# EAGLE board rev_m_v4 (EAGLE 9.7.0)
REV: M
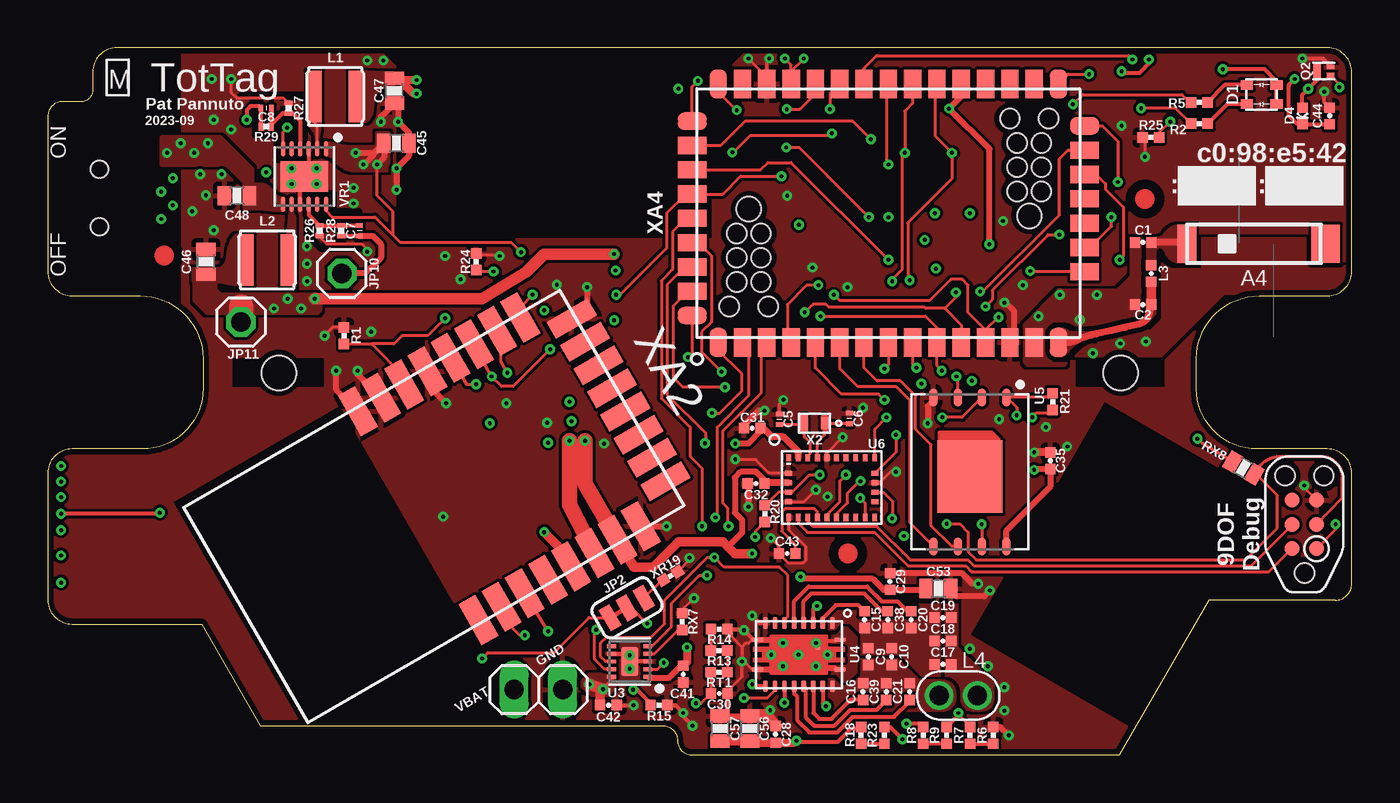
[diagram p5: board, top side]
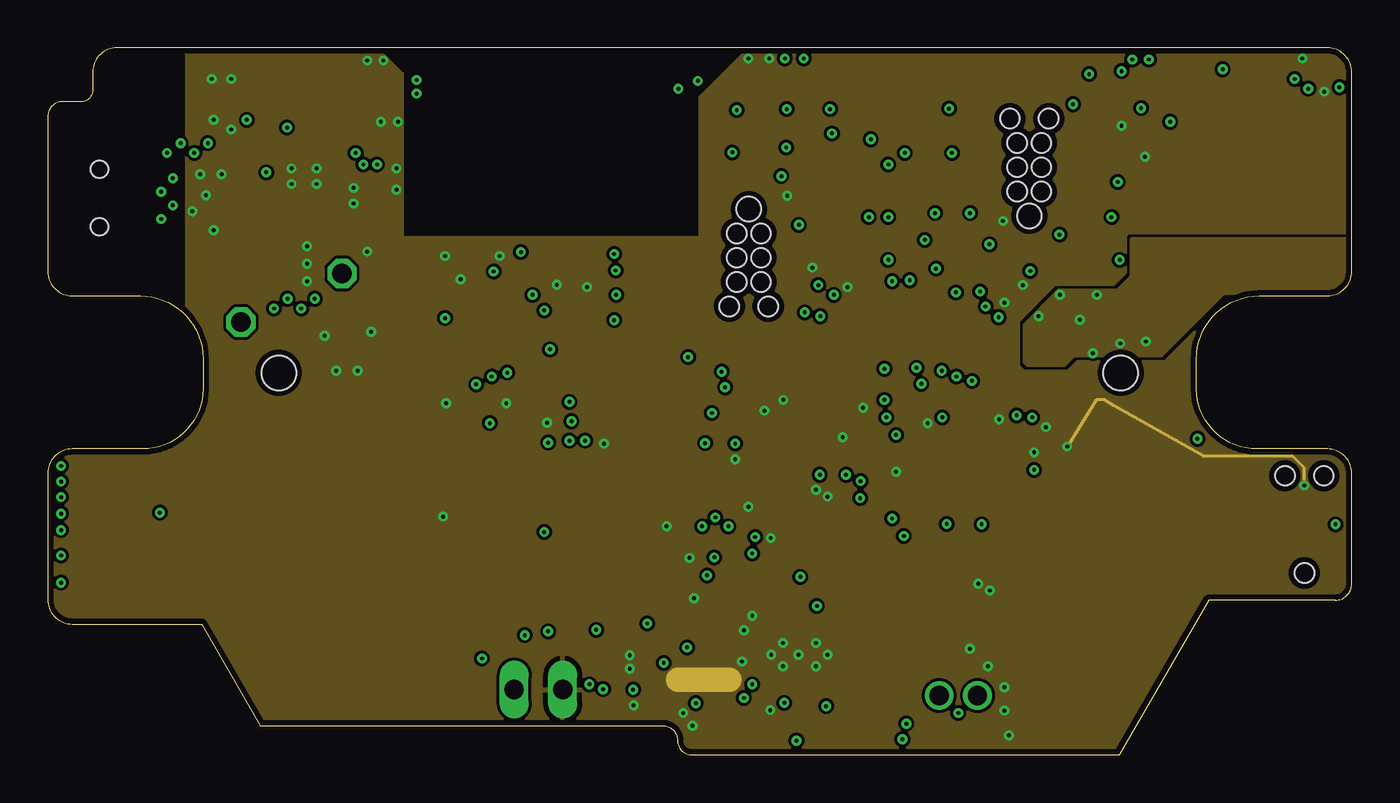
[diagram p6: board, inner layer Route2]
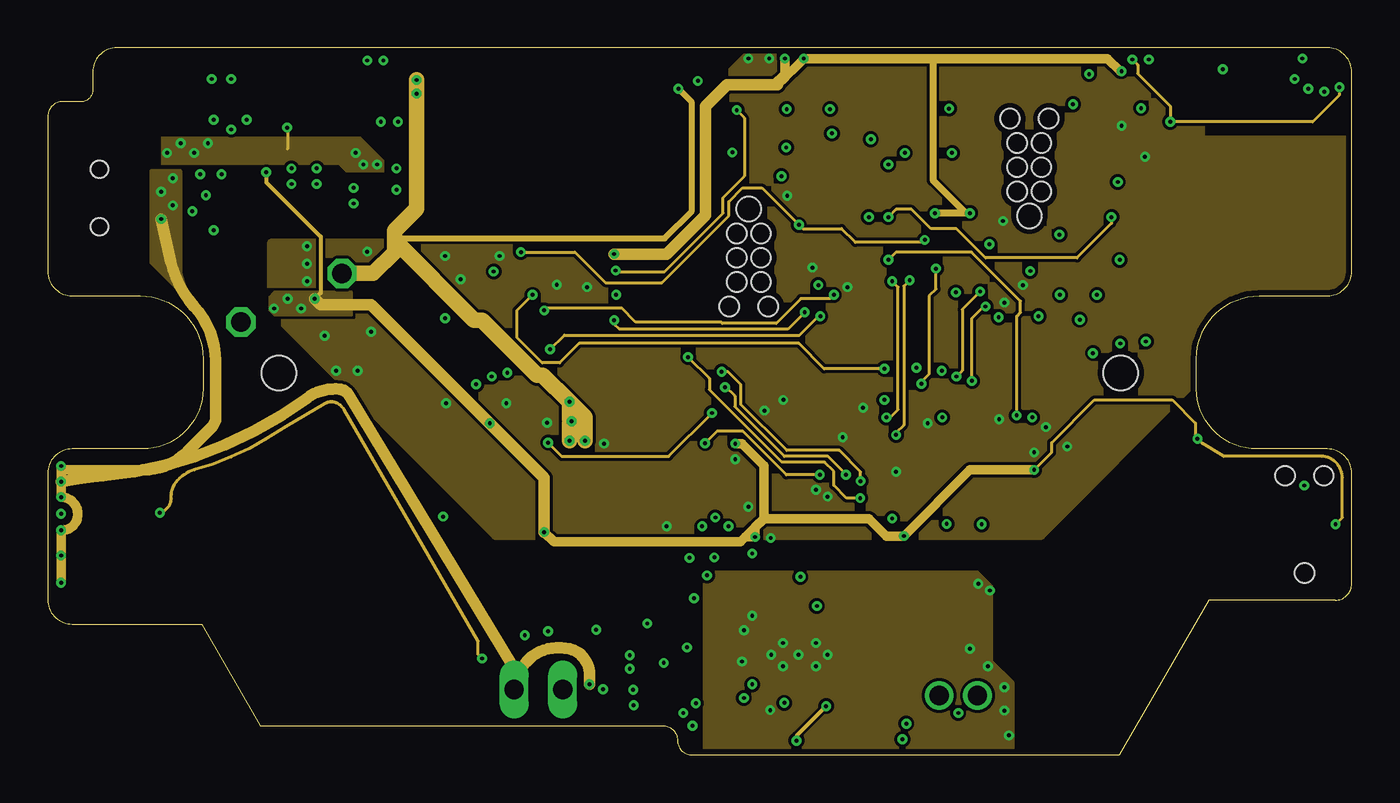
[diagram p7: board, inner layer Route15]
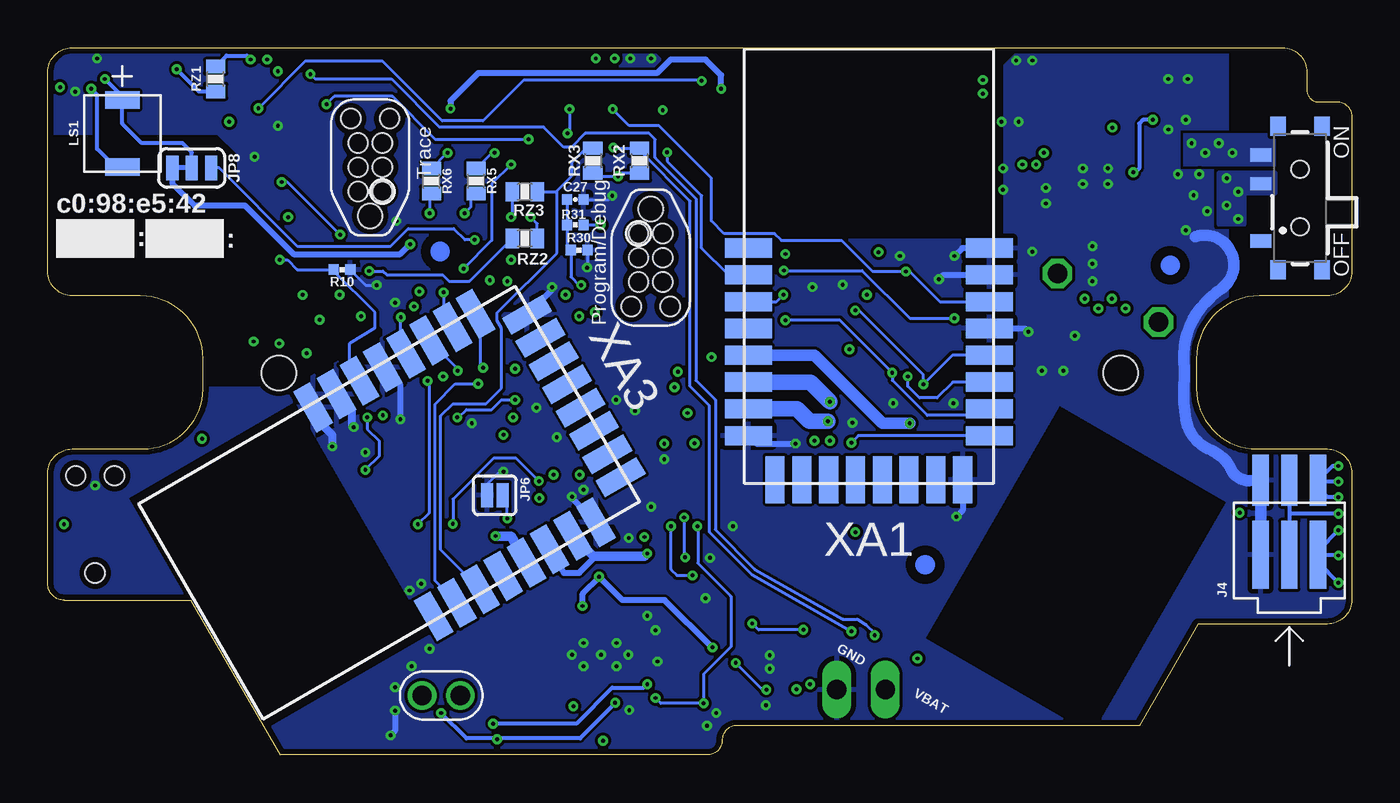
[diagram p8: board, bottom side, seen from below]

Size 68.14 x 36.93 mm. Coordinates in mm from the lower left corner, seen from the top.
Outline: 66.87,36.93 3.61,36.93 arc90 2.34,35.66 2.34,34.7 arc-90 1.76,34.12 0.76,34.12 arc90 0,33.36 0,25.25 arc90 1.27,23.98 4.83,23.98 arc-90 8.11,20.69 8.11,19.14 arc-90 4.95,15.98 1.27,15.98 arc90 0,14.71 0,8.1 arc90 1.27,6.83 8.03,6.83 11.11,1.52 32.14,1.52 arc-90 32.9,0.76 arc90 33.66,0 55.99,0 60.66,8.08 67.29,8.08 arc90 68.14,8.92 68.14,14.71 arc90 66.87,15.98 63.18,15.98 arc-90 60.02,19.14 60.02,20.69 arc-90 63.31,23.98 66.87,23.98 arc90 68.14,25.25 68.14,35.66 arc90 66.87,36.93
Copper layers (1+2*15+16): Top 0.0356mm / dielectric 0.18mm / Route2 0.0356mm / dielectric 1.03mm / Route15 0.0356mm / dielectric 0.18mm / Bottom 0.0356mm
Design rules "quickturn_co_kr_1oz_4lyr *": minimum track width 6mil, minimum drill 8mil, track to track 6mil, track to pad 6mil, pad to pad 6mil, via to via 12mil, smd to smd 6mil, copper to edge 12mil, drill to drill 12mil, minimum pad ring 8mil, minimum via ring 6mil, stop-mask expansion 4mil, vias tented up to drill 10mil, thermal gap 10mil
Net classes: 1 BLE_RF: width 0.356 mm, clearance 0.254 mm; 2 UWB_RF: width 0.356 mm, clearance 0.254 mm
Holes 1.8 mm at 12.07,19.95 56.07,19.95
tRestrict: area 9.7,19.3 to 14.4,20.7; area 53.8,19.3 to 58.3,20.7; area 13.4,26.4 to 16.5,29.4; area 10,31 to 13.5,34.6

## Footprints (pad centres in the part's own frame; a part is rotated, then mirrored left to right if it is on the bottom)
AMCA72-2R470G-S1F-T = smd 2 x 1.5: NC 0,3.75 | smd 2 x 1: S1 0,-3.5
0402_CAP = smd 0.536 x 0.546: 1 -0.433,0; 2 0.433,0
0201_CAP = smd 0.25 x 0.35: P$1 -0.275,0; P$2 0.275,0
0603_CAP = smd 0.7 x 1: 1 -0.65,0; 2 0.65,0
LED-0606 = smd 0.65 x 0.5: A1 0.775,0.5; A2 0.775,-0.5; C1 -0.775,0.5; C2 -0.775,-0.5
0402_DIODE = smd 0.536 x 0.546: ANODE -0.433,0; CATHODE 0.433,0
TC2030-IDC-NL = smd 0.787 x 0.787: 1 -1.27,-0.635; 2 -1.27,0.635; 3 0,-0.635; 4 0,0.635; 5 1.27,-0.635; 6 1.27,0.635 | hole 1.016: -2.54,0; 2.54,1.016; 2.54,-1.016
MOLEX-PICO-SPOX-3_SIDE = smd 3.55 x 0.85: 1 -1.725,1.5; 2 -1.725,0; 3 -1.725,-1.5 | smd 2.65 x 0.85: 1SUPP 2.175,1.5; 2SUPP 2.175,0; 3SUPP 2.175,-1.5
SMT-JUMPER_3_1-NC_TRACE_SILK = smd 0.635 x 1.27: 1 -1.016,0; 2 0,0; 3 1.016,0
SMT-JUMPER_2_NO_SILK = smd 0.635 x 1.27: 1 -0.406,0; 2 0.406,0
1X02 = drill 1.016 long: 1 -1.27,0; 2 1.27,0
1X01 = drill 1.016 octagon: 1 0,0
NRX3015 = smd 0.8 x 2.7: P$1 -1.1,0; P$2 1.1,0
WURTH_COIL_760308103204 = drill 1: P$1 0,1; P$2 0,-1
SMT-0440-T-2-R = smd 0.9 x 1.8: + 1.75,0; - -1.75,0
XFDFN-3 = smd 0.4 x 0.7: D 0.35,0 | smd 0.4 x 0.25: G -0.35,0.215; S -0.35,-0.215
0402_RES = smd 0.536 x 0.546: 1 -0.433,0; 2 0.433,0
0201_RES = smd 0.28 x 0.43: 1 -0.255,0; 2 0.255,0
0603-RES = smd 0.7 x 1: 1 -0.65,0; 2 0.65,0
450404015514 = smd 0.7 x 1.1: 1 2.25,-2.05; 2 -0.75,-2.05; 3 -2.25,-2.05 | smd 1 x 0.8: Z1 -3.75,1.15; Z2 3.75,1.15; Z3 3.75,-1.15; Z4 -3.75,-1.15 | hole 0.9: -1.5,0; 1.5,0
DSQ0010A = smd 0.5 x 0.2: 1 -0.95,0.8; 2 -0.95,0.4; 3 -0.95,0; 4 -0.95,-0.4; 5 -0.95,-0.8; 6 0.95,-0.8; 7 0.95,-0.4; 8 0.95,0; 9 0.95,0.4; 10 0.95,0.8 | smd 0.9 x 1.5: PAD 0,0
RHL0020A = smd 0.24 x 0.6: 1 -0.775,2.15; 10 -0.775,-2.15; 11 0.775,-2.15; 20 0.775,2.15 | smd 0.6 x 0.24: 2 -1.65,1.75; 3 -1.65,1.25; 4 -1.65,0.75; 5 -1.65,0.25; 6 -1.65,-0.25; 7 -1.65,-0.75; 8 -1.65,-1.25; 9 -1.65,-1.75; 12 1.65,-1.75; 13 1.65,-1.25; 14 1.65,-0.75; 15 1.65,-0.25; 16 1.65,0.25; 17 1.65,0.75; 18 1.65,1.25; 19 1.65,1.75; PAD -0.55,1
WSON127P800X600X80-9T430X340N = smd 0.94 x 0.445: 1 -3.896,1.905; 2 -3.896,0.635; 3 -3.896,-0.635; 4 -3.896,-1.905; 5 3.896,-1.905; 6 3.896,-0.635; 7 3.896,0.635; 8 3.896,1.905 | smd 3.8 x 3.4: PAD 0.25,0
LGA28R0P510X4_5P2X3P8X1 = smd 0.25 x 0.375: 1 -2.25,1.562; 6 -2.25,-1.562; 7 -1.75,-1.562; 8 -1.25,-1.562; 9 -0.75,-1.562; 10 -0.25,-1.562; 11 0.25,-1.562; 12 0.75,-1.562; 13 1.25,-1.562; 14 1.75,-1.562; 15 2.25,-1.562; 20 2.25,1.562; 21 1.75,1.562; 22 1.25,1.562; 23 0.75,1.562; 24 0.25,1.562; 25 -0.25,1.562; 26 -0.75,1.562; 27 -1.25,1.562; 28 -1.75,1.562 | smd 0.375 x 0.25: 2 -2.263,0.75; 3 -2.263,0.25; 4 -2.263,-0.25; 5 -2.263,-0.75; 16 2.263,-0.75; 17 2.263,-0.25; 18 2.263,0.25; 19 2.263,0.75
SON45P300X300X80-13T160X250N = smd 0.813 x 0.224: 1 -1.445,1.125; 2 -1.445,0.675; 3 -1.445,0.225; 4 -1.445,-0.225; 5 -1.445,-0.675; 6 -1.445,-1.125; 7 1.445,-1.125; 8 1.445,-0.675; 9 1.445,-0.225; 10 1.445,0.225; 11 1.445,0.675; 12 1.445,1.125 | smd 1.6 x 2.5: 13 0,0
TXC-9HT12 = smd 0.4 x 0.6: 1 -0.53,0 | smd 0.4 x 0.86: 2 0.53,0
DWM3000 = smd 2.45 x 1: 1 -6.295,12.3; 2 -6.295,10.9; 3 -6.295,9.5; 4 -6.295,8.1; 5 -6.295,6.7; 6 -6.295,5.3; 7 -6.295,3.9; 8 -6.295,2.5; 17 6.295,2.5; 18 6.295,3.9; 19 6.295,5.3; 20 6.295,6.7; 21 6.295,8.1; 22 6.295,9.5; 23 6.295,10.9; 24 6.295,12.3 | smd 1 x 2.45: 9 -4.9,0.205; 10 -3.5,0.205; 11 -2.1,0.205; 12 -0.7,0.205; 13 0.7,0.205; 14 2.1,0.205; 15 3.5,0.205; 16 4.9,0.205
APOLLO4_BLUEPLUS_MODULE = smd 1.5 x 0.9: P1 -6.75,8.89; P2 -6.75,7.62; P3 -6.75,6.35; P4 -6.75,5.08; P5 -6.75,3.81; P6 -6.75,2.54; P7 -6.75,1.27; P8 -6.75,0; P9 -6.75,-1.27; P10 -6.75,-2.54; P11 -6.75,-3.81; P12 -6.75,-5.08; P13 -6.75,-6.35; P14 -6.75,-7.62; P15 -6.75,-8.89; P25 6.75,-8.89; P26 6.75,-7.62; P27 6.75,-6.35; P28 6.75,-5.08; P29 6.75,-3.81; P30 6.75,-2.54; P31 6.75,-1.27; P32 6.75,0; P33 6.75,1.27; P34 6.75,2.54; P35 6.75,3.81; P36 6.75,5.08; P37 6.75,6.35; P38 6.75,7.62; P39 6.75,8.89 | smd 0.9 x 1.5: P18 -3.06,-10.25; P19 -1.79,-10.25; P20 -0.52,-10.25; P21 0.75,-10.25; P22 2.02,-10.25; P23 3.29,-10.25; P24 4.56,-10.25; P40 4.81,10.25; P41 3.54,10.25; P42 2.27,10.25; P43 1,10.25; P44 -0.27,10.25; P45 -1.54,10.25; P46 -2.81,10.25; P47 -4.08,10.25; P48 -5.35,10.25 | hole 1.27: -0.143,-7.366; 0.213,7.29 | hole 1.016: 4.937,-6.35; 4.937,-8.382; 1.127,-8.001; 1.127,-6.731; 2.397,-8.001; 2.397,-6.731; 3.667,-6.731; 3.667,-8.001; -4.867,6.274; -4.867,8.306; -1.057,7.925; -1.057,6.655; -2.327,7.925; -2.327,6.655; -3.597,6.655; -3.597,7.925

## Placement (x,y rotation side)
A4  AMCA72-2R47G-S1F-T  [AMCA72-2R470G-S1F-T]  63.02,26.7 270 top
C1  0.5pF  [0402_CAP]  57.23,26.77 180 top
C2  0.8pF  [0402_CAP]  57.23,23.52 180 top
C5  4pF  [0201_CAP]  38.23,17.53 270 top
C6  4pF  [0201_CAP]  41.89,17.58 270 top
C7  22pF  [0201_CAP]  16.29,27.38 90 top
C8  22pF  [0201_CAP]  11.41,33.78 180 top
C9  470pF  [0402_CAP]  42.88,5.13 270 top
C10  470pF  [0402_CAP]  44.1,5.13 270 top
C15  10nF  [0402_CAP]  42.68,7.06 270 top
C16  10nF  [0402_CAP]  42.6,3.3 90 top
C17  22nF  [0402_CAP]  46.77,4.72 0 top
C18  22nF  [0402_CAP]  46.77,5.94 0 top
C19  22nF  [0402_CAP]  46.77,7.16 0 top
C20  22nF  [0402_CAP]  45.12,7.06 270 top
C21  22nF  [0402_CAP]  45.04,3.3 90 top
C27  0.1uF  [0402_CAP]  40.57,29.01 0 bottom
C28  0.1uF  [0402_CAP]  38.03,1.07 90 top
C29  0.1uF  [0402_CAP]  44.01,9.05 90 top
C30  0.1uF  [0402_CAP]  35.08,3.2 0 top
C31  0.1uF  [0402_CAP]  36.81,17.07 180 top
C32  0.1uF  [0402_CAP]  37.01,14.17 180 top
C35  0.1uF  [0402_CAP]  52.39,15.36 90 top
C38  0.47uF  [0402_CAP]  43.9,7.06 270 top
C39  0.47uF  [0402_CAP]  43.82,3.3 90 top
C41  1uF  [0402_CAP]  33.2,4.22 270 top
C42  1uF  [0402_CAP]  29.29,2.59 0 top
C43  1uF  [0402_CAP]  38.64,10.52 180 top
C44  1uF  [0402_CAP]  66.99,33.38 90 top
C45  4.7uF  [0603_CAP]  18.22,31.95 180 top
C46  4.7uF  [0603_CAP]  8.26,25.76 90 top
C47  4.7uF  [0603_CAP]  18.12,34.7 90 top
C48  4.7uF  [0603_CAP]  9.89,29.21 180 top
C53  10uF  [0603_CAP]  46.54,8.69 0 top
C56  10uF  [0603_CAP]  36.68,1.37 90 top
C57  10uF  [0603_CAP]  35.13,1.37 90 top
D1  BICOLOR-SMD  [LED-0606]  63.43,34.49 0 top
D4  DIODE0402  [0402_DIODE]  65.56,33.38 270 top
FD1  FIDUCIAL  [FIDUCIAL_1MM-CU_2MM-MASK]  6.08,26.09 0 top
FD2  FIDUCIAL  [FIDUCIAL_1MM-CU_2MM-MASK]  57.34,29.03 0 top
FD3  FIDUCIAL  [FIDUCIAL_1MM-CU_2MM-MASK]  41.81,10.52 0 top
FD4  FIDUCIAL  [FIDUCIAL_1MM-CU_2MM-MASK]  9.48,25.58 0 bottom
FD5  FIDUCIAL  [FIDUCIAL_1MM-CU_2MM-MASK]  47.64,26.29 0 bottom
FD6  FIDUCIAL  [FIDUCIAL_1MM-CU_2MM-MASK]  22.29,9.93 0 bottom
J1  TC2030-JLINK-NL  [TC2030-IDC-NL]  65.67,12.04 90 top
J4  MOLEX-PICO-SPOX-3SIDE  [MOLEX-PICO-SPOX-3_SIDE]  3.26,12.17 90 bottom
JP2  JUMPER-SMT_3_1-NC_TRACE_SILK  [SMT-JUMPER_3_1-NC_TRACE_SILK]  30.26,7.67 210 top
JP6  JUMPER-SMT_2_NO_SILK  [SMT-JUMPER_2_NO_SILK]  44.78,13.56 0 bottom
JP8  JUMPER-SMT_3_1-NC_TRACE_SILK  [SMT-JUMPER_3_1-NC_TRACE_SILK]  60.61,30.66 180 bottom
JP9  [1X02]  25.64,3.4 0 top
JP10  [1X01]  15.37,25.15 180 top
JP11  [1X01]  10.09,22.61 0 top
L1  10uH  [NRX3015]  15.02,34.39 0 top
L2  10uH  [NRX3015]  11.46,25.86 0 top
L3  4.7nH  [0402_CAP]  57.66,25.15 270 top
L4  WURTH_COIL_760308103204  [WURTH_COIL_760308103204]  47.58,3.1 270 top
LS1  PUI_SMT-0440-T-2-R  [SMT-0440-T-2-R]  64.24,32.46 90 bottom
Q2  MOSFET-NCHANNELXFDN-3  [XFDFN-3]  66.68,35.71 180 top
R1  100k  [0402_RES]  15.48,21.89 270 top
R2  5.1  [0402_RES]  60.18,32.97 180 top
R5  15  [0402_RES]  60.18,34.09 180 top
R6  97.6  [0402_RES]  49.41,1.02 90 top
R7  97.6  [0402_RES]  48.19,1.02 270 top
R8  162  [0402_RES]  45.75,1.02 270 top
R9  162  [0402_RES]  46.97,1.02 90 top
R10  100k  [0402_RES]  52.76,25.35 180 bottom
R13  1k  [0402_RES]  35.08,5.44 0 top
R14  1k  [0402_RES]  35.08,6.56 180 top
R15  2.2k  [0402_RES]  31.93,2.59 180 top
R18  10k  [0402_RES]  42.5,1.02 270 top
R20  10k  [0402_RES]  37.47,12.6 270 top
R21  10k  [0402_RES]  52.51,18.45 270 top
R23  10k  [0402_RES]  43.72,1.02 90 top
R24  100k  [0402_RES]  22.38,25.76 270 top
R25  100k  [0402_RES]  57.64,32.26 180 top
R26  261k  [0201_RES]  14.21,27.38 90 top
R27  402k  [0201_RES]  12.58,33.78 270 top
R28  845k  [0201_RES]  15.32,27.38 270 top
R29  845k  [0201_RES]  11.41,32.82 0 top
R30  1.87M  [0402_RES]  40.37,26.37 180 bottom
R31  5.1M  [0402_RES]  40.57,27.69 0 bottom
RT1  10k@25C  [0402_RES]  35.08,4.31 180 top
RX2  DNP  [0603-RES]  37.22,31.04 270 bottom
RX3  DNP  [0603-RES]  39.66,31.04 270 bottom
RX5  DNP  [0603-RES]  45.75,29.97 90 bottom
RX6  DNP  [0603-RES]  48.09,29.97 90 bottom
RX7  DNP  [0402_RES]  33.15,6.96 270 top
RX8  DNP  [0603-RES]  62.48,14.99 150 top
RZ1  0  [0603-RES]  59.37,35.31 90 bottom
RZ2  0  [0603-RES]  43.21,26.97 180 bottom
RZ3  0  [0603-RES]  43.21,29.41 180 bottom
S1  [450404015514]  2.7,29.08 270 bottom
U3  BQ24040  [DSQ0010A]  30.41,4.88 180 top
U4  BQ51013B  [RHL0020A]  39.25,5.23 270 top
U5  W25N01GWZEIG  [WSON127P800X600X80-9T430X340N]  48.19,14.78 270 top
U6  BNO055  [LGA28R0P510X4_5P2X3P8X1]  40.96,13.96 0 top
VR1  RT8020RT8020GQW  [SON45P300X300X80-13T160X250N]  13.41,30.21 270 top
X2  TXC-9HT12  [TXC-9HT12]  40.06,17.32 180 top
XA1  DWM3000  [DWM3000]  25.23,14.17 0 bottom
XA2  DWM3000  [DWM3000]  30,18.64 120 top
XA3  DWM3000  [DWM3000]  40.47,18.85 120 bottom
XA4  APOLLO4_BLUEPLUS_MODULE  [APOLLO4_BLUEPLUS_MODULE]  43.92,28.3 90 top
XR19  10k  [0402_RES]  32.54,9.35 210 top

## Tracks (layer width: path | path; a pad name or v marks a point on that pad's centre or on a via)
9DOF_!BOOT_LOAD_PIN  (via drill 0.2)
  Top 0.152: R20.1 37.5,13.03 38.18,13.71 U6.4 38.89,13.71 39.81,14.63 v40.34,14.63 | XA4.P46 33.29,25.49 32.37,24.56 32.37,18.82 34.37,16.81 34.37,16.31 v34.35,16.28
  Route15 0.152: v40.34,14.63 38.59,14.63 36.3,16.92 34.98,16.92 v34.35,16.28
9DOF_!RESET  (via drill 0.2)
  Top 0.152: XA4.P45 33.98,26.76 34.68,26.06 34.68,22.61 34.17,22.1 34.17,21.06 v35.21,20.02 | U6.11 41.21,12.58 41.79,13.16 41.79,13.67 42.45,14.33 v42.47,14.3 | v46.97,12.06 47.66,12.06 48.09,11.63 48.09,10.62 48.52,10.19 62.11,10.19 62.16,10.19 62.59,10.19 64.24,11.84 64.24,13.56 63.15,14.66 RX8.1 63.3,15.02 arc-56 64.45,15.6 arc2 66.48,15.6 66.53,15.6 arc-90 67.65,14.48 67.65,13.44 J1.3
  Route15 0.152: v42.47,14.3 42.47,14.78 41.36,15.9 38.61,15.9 36.2,18.31 36.2,19.35 35.54,20.02 v35.21,20.02
  Bottom 0.152: v42.47,14.3 43.67,15.49 44.84,15.49 46.97,13.36 v46.97,12.06
9DOF_BL_IND  (via drill 0.2)
  Top 0.152: XA4.P47 33.44,24.22 32.67,23.44 32.67,19.74 33.2,19.2 v35.39,19.2 | U6.10 40.71,12.54 41.38,13.21 41.38,14.3 v41.71,14.63
  Route15 0.152: v41.71,14.63 41.71,14.66 40.77,15.6 38.49,15.6 35.9,18.19 35.9,18.75 35.44,19.2 v35.39,19.2
9DOF_CAP
  Top 0.152: U6.9 40.21,12.7 40.06,12.85 38.51,12.85 38.36,12.7 38.36,11.68 39.07,10.97 C43.1
9DOF_INT  (via drill 0.2)
  Top 0.152: XA4.P48 33.67,20.99 v33.46,20.78 | U6.14 42.71,13.15 v42.45,13.41
  Route15 0.152: v42.45,13.41 41.74,13.41 41.08,14.07 41.08,14.81 40.6,15.29 38.36,15.29 34.58,19.08 34.58,19.66 v33.46,20.78
9DOF_SCL-COM1  (via drill 0.2)
  Top 0.152: XA4.P30 46.36,34.94 46.36,32.33 v47.25,31.45 47.25,30.1 44.94,27.79 44.94,24.89 v45.04,24.79 | U6.19 44.33,15.82 v44.33,16.71
  Route15 0.152: v44.33,16.71 44.33,16.81 44.74,17.22 44.74,24.49 v45.04,24.79
  Bottom 0.152: RX6.2 47.27,31.45 v47.25,31.45
9DOF_SDA-COM0  (via drill 0.2)
  Top 0.152: XA4.P31 45.19,34.04 44.79,33.63 v44.79,31.45 44.63,31.29 44.63,25.35 44.13,24.84 v44.13,24.74 | U6.20 43.21,17.02 v43.82,17.63
  Route15 0.152: v43.82,17.63 44.02,17.63 44.43,18.03 44.43,24.43 v44.13,24.74
  Bottom 0.152: RX5.2 44.93,31.45 v44.79,31.45
9DOF_SWCLK
  Top 0.152: U6.8 39.71,12.2 39.99,11.92 43.33,11.92 45.07,10.19 48.09,10.19 48.39,9.88 62.9,9.88 65.03,12.01 J1.4
9DOF_SWDIO
  Top 0.152: U6.7 39.21,12.1 39.7,11.61 43.2,11.61 44.95,9.87 47.97,9.87 48.27,9.58 63.81,9.58 65,10.77 J1.2
9DOF_XI
  Top 0.152: U6.27 39.71,15.63 39.82,15.73 39.82,16.33 39.53,16.61 X2.2 39.46,17.25 C5.P$2
9DOF_XO
  Top 0.152: U6.26 40.21,16.33 40.59,16.71 X2.1 41.87,17.32 C6.P$2
!CHG  (via drill 0.2)
  Top 0.152: U4.7 38.5,7.07 38.67,7.24 38.67,9.37 38.23,9.8 35.34,9.8 v34.83,10.31 34.47,10.31 32.24,8.08 32.24,6.86 31.53,6.15 29.19,6.15 28.89,5.84 28.89,5.13 29.14,4.88 U3.8 | XA4.P2 36.61,21.24 36.61,18.75 34.98,17.12 34.98,12.5 v34.88,12.4
  Bottom 0.152: v34.88,12.4 34.88,10.36 v34.83,10.31
!DWM1_RST  (via drill 0.2)
  Top 0.152: v38.34,30.23 36.2,30.23 35.27,29.3 XA4.P43 33.34,29.3 32.34,28.3 32.34,26.47 29.9,24.03 v29.7,24.03
  Bottom 0.152: RX2.2 38.17,30.39 v38.34,30.23 39.49,30.23 RX3.2 | XA1.3 30.05,23.67 v29.7,24.03
!DWM1_SPI_CS  (via drill 0.2)
  Top 0.152: v34.7,17.86 35.11,17.86 36.25,19 36.25,19.92 35.03,21.14 XA4.P1
  Route15 0.152: v26.14,16.31 26.85,15.6 32.44,15.6 v34.7,17.86
  Bottom 0.152: XA1.17 25.78,16.67 v26.14,16.31
!DWM2_RST  (via drill 0.2)
  Top 0.152: v26.14,6.45 XA2.3 | v42.91,28.09 39.27,31.72 v38.59,31.72
  Bottom 0.152: v26.14,6.45 31.36,9.43 33.56,11.63 33.56,18.24 34.58,19.25 34.58,28.93 37.22,31.57 RX2.1 38.55,31.69 v38.59,31.72 | RZ2.1 42.56,27.75 v42.91,28.09
!DWM2_SPI_CS  (via drill 0.2)
  Top 0.152: XA4.P8 43.92,20.37 v43.72,20.17 | XA2.17 24.69,23.39 v25.33,24.03
  Route15 0.152: v43.72,20.17 40.57,20.17 39.25,21.49 27.77,21.49 26.75,20.47 25.84,20.47 24.52,21.79 24.52,23.22 v25.33,24.03
!DWM3_RST
  Bottom 0.152: RX3.1 40.02,31.69 40.77,30.94 40.77,30.23 41.54,29.46 | XA3.3 47.61,10.7 47.61,17.7 46.97,18.34 45.24,18.34 44.43,19.15 44.43,22.28 44.66,22.68 44.66,23.09 41.54,26.21 41.54,29.46 | RZ3.1 41.59,29.41 41.54,29.46
!DWM3_SPI_CS  (via drill 0.2)
  Top 0.152: XA4.P9 45.19,20.42 v45.4,20.22
  Bottom 0.152: XA3.17 45.55,22.82 45.55,20.37 v45.4,20.22
!PG  (via drill 0.2)
  Top 0.152: U3.5 31.56,5.68 32.58,6.69 32.58,7.91 34.04,9.37 v34.45,9.37 | v35.57,11.94 35.52,11.99 35.52,12.9 35.29,13.13 35.29,16.92 37.27,18.9 37.27,21.24 XA4.P3
  Bottom 0.152: v34.45,9.37 35.26,9.37 35.57,9.68 v35.57,11.94
+1V8  (via drill 0.2)
  Top 0.152: R20.2 36.96,11.66 v36.96,11.38 | R21.2 52.33,17.83 51.64,17.83 v51.44,17.63 | v39.5,36.37 38.84,35.71 XA4.P36 38.84,36.04 v38.51,36.37 | RX8.2 60.32,16.27 v60.08,16.51 | J1.1 67.29,11.76 v67.29,12.04
  Top 0.203: R29.1 11.14,32.84 C8.P$2 11.03,33.88 10.6,33.88 10.39,33.68 v10.39,33.17 | v57.54,36.32 57.54,36.12 57.03,35.61 56.22,35.61 v56.11,35.71
  Top 0.305: U5.8 50.09,11.71 52.39,14 C35.1 51.59,14.93 v51.54,14.88 | C31.1 37.24,16.89 36.61,16.26 v35.92,16.26
  Top 0.356: U6.28 39.21,15.83 38.44,16.61 37.85,16.61 37.4,17.07 C31.1
  Top 0.508: XA2.5 27.35,10.22 v25.94,11.63
  Top 0.61: v13.95,23.83 22.69,23.83 25.03,25.25 25.94,26.16 v29.6,26.16
  Top 1.27: JP11.1 10.09,23.42
  Route15 0.152: v51.54,14.88 52.46,15.8 52.46,16.31 54.69,18.54 58.76,18.54 59.98,17.32 59.98,16.61 v60.08,16.51 60.32,16.27 61.45,15.6 66.58,15.6 arc-87 67.65,14.48 67.65,12.4 v67.29,12.04
  Route15 0.203: v11.41,30.43 11.41,29.92 14.26,27.08 14.26,24.13 v13.95,23.83
  Route15 0.356: v46.36,28.3 v48.19,28.3 47.99,28.3 46.26,30.02 46.26,36.37
  Route15 0.508: v38.51,36.37 38.51,35.48 | 38.13,35 v39.5,36.37 46.26,36.37 55.38,36.37 56.04,35.71 v56.11,35.71 | v25.94,11.63 26.45,11.13 36.2,11.13 36.46,11.38 | 37.42,12.34 42.91,12.34 43.82,11.43 v44.74,11.43 48.19,14.88 v51.54,14.88 | v35.92,16.26 36.28,16.26 37.42,15.11 37.42,12.34 | 36.46,11.38 36.96,11.89 | 36.96,11.89 37.42,12.34 | 36.46,11.38 v36.96,11.38 36.96,11.89
  Route15 0.61: v13.95,23.83 14.26,23.52 16.9,23.52 v23.09,17.32 25.94,14.48 v25.94,11.63 | 38.51,35.48 38.03,35 | 38.13,35 38.03,35 | 38.03,35 35.49,35 34.37,33.88 34.37,28.19 32.34,26.16 v29.6,26.16
  Bottom 0.152: RX5.1 46.06,29.02 46.06,28.6 v46.36,28.3 | RX6.1 48.19,29.22 v48.19,28.3 | v51.44,17.63 51.44,17.02 50.83,16.41 50.83,15.6 v51.54,14.88
  Bottom 0.203: v10.39,33.17 10.9,33.17 11.11,32.97 11.11,30.63 11.31,30.43 v11.41,30.43 | RZ1.2 58.8,36.53 57.74,36.53 v57.54,36.32
  Bottom 0.508: XA3.5 43.92,11.43 v44.74,11.43
  Bottom 0.61: XA1.5 28.07,20.87 24.51,17.32 v23.1,17.32 v23.09,17.32
  other vias: 11.82,23.32 12.53,23.83 13.24,23.32
  pour Top (isolate 0.102, no thermals): 14.15,24.12 9.07,24.12 8.86,24.33 8.86,25.03 7.56,25.03 7.56,23.73 8.27,23.03 14.15,23.03 14.34,23.22 14.34,23.92
  pour Top (isolate 0.102, no thermals): 9.74,24.61 10.67,24.61 10.67,27.13 9.97,27.13 9.89,27.12 9.82,27.09 9.77,27.05 9.72,26.99 9.59,26.77 9.49,26.52 9.43,26.27 9.41,26.02 9.41,26.02 9.4,26 9.4,25.98 9.4,25.98 9.39,25.89 9.39,25.88 9.39,25.87 9.39,25.86 9.38,25.85 9.35,25.76 9.35,25.75 9.35,25.74 9.34,25.73 9.34,25.72 9.29,25.63 9.29,25.63 9.28,25.62 9.28,25.61 9.27,25.6 9.21,25.53 9.21,25.52 9.2,25.51 9.19,25.5 9.19,25.5 9.16,25.47 9.15,25.45 9.14,25.45 9.14,25.45 9.13,25.44 9.08,25.41 9.07,25.41 9.07,25.4 9.06,25.4 9.05,25.4 9,25.38 8.99,25.38 8.98,25.38 8.97,25.38 8.96,25.38 8.92,25.38 8.92,25.37 8.9,25.37 8.88,25.37 8.88,25.37 7.6,25.37 7.6,24.74 8.88,24.74 8.88,24.74 8.9,24.74 8.92,24.74 8.92,24.74 9.07,24.73 9.08,24.73 9.09,24.73 9.1,24.73 9.11,24.72 9.25,24.69 9.25,24.69 9.27,24.69 9.29,24.68 9.29,24.68 9.51,24.63
  pour Route15 (rank 2): 11.84,22.96 15.9,22.96 15.9,24.18 11.84,24.18 11.56,23.91 11.56,23.24
+2V5  (via drill 0.2)
  Top 0.203: R28.2 16.27,27.13 C7.P$1
  Top 0.305: C7.P$1 16.97,27.11 17.41,26.67 17.41,25.96 16.59,25.15 JP10.1 | C47.2 18.32,35.35 | C32.1 37.45,14.35 37.01,14.78 36.2,14.78 35.9,14.48 35.9,12.65 36.28,12.27 36.28,11.61 35.54,10.87 | XA4.P29 47.73,34.39 v47.1,33.76 49.21,31.65 v49.21,26.67
  Top 0.356: U6.3 37.49,14.21 C32.1
  Top 0.406: v19.26,34.54 19.12,34.54 18.32,35.35 | C47.2 18.22,35.24 19.25,35.24 v19.26,35.26
  Top 0.508: v36.81,10.52 35.9,10.52 35.54,10.87 35.29,11.13 32.95,11.13 31.63,9.8 30.64,9.8 XA2.7
  Top 0.813: XA2.7 28.07,14.17 v28.07,16.41 | XA2.6 27.26,13.06 v27.26,16.41
  Route15 0.305: 18.12,26.87 18.22,26.97 32.24,26.97 33.66,28.4 33.66,34.09 v32.95,34.8
  Route15 0.813: v19.26,35.26 19.26,28.53 18.12,27.38 18.12,26.87 | 18.12,26.87 18.12,26.26 17,25.15 JP10.1 | 18.12,26.87 22.28,22.71 22.7,22.71 25.57,19.84 25.86,19.84 v27.26,18.44 | v27.26,18.44 27.26,17.53 v27.36,17.42 27.26,17.32 v27.26,16.41 | v27.26,18.44 28.07,17.63 v28.07,16.41
  Bottom 0.305: XA3.6 41.18,9.5 40.37,9.5 39.5,10.36 | JP8.3 61.63,29.84 60.48,28.7 57.84,28.7 55.3,26.16 49.71,26.16 v49.21,26.67 | v32.95,34.8 32.95,35.51 33.76,36.32 35.59,36.32 36.3,35.61 45.65,35.61 47.1,34.16 v47.1,33.76
  Bottom 0.508: XA3.7 39.62,10.36 39.5,10.36 36.96,10.36 v36.81,10.52
  Bottom 0.813: XA1.7 28.98,18.07 28.33,17.42 v27.36,17.42 | XA1.6 28.29,19.47 v27.26,18.44
  pour Top (isolate 0.102, no thermals): 15.81,33.12 16.54,33.12 16.6,33.13 16.66,33.14 16.7,33.17 16.74,33.21 16.84,33.37 16.91,33.54 16.96,33.72 16.97,33.9 16.97,33.9 16.97,33.92 16.98,33.94 16.98,33.94 16.99,34.14 16.99,34.15 17,34.16 17,34.17 17,34.18 17.06,34.39 17.06,34.4 17.06,34.41 17.07,34.42 17.07,34.43 17.17,34.62 17.17,34.63 17.18,34.64 17.18,34.65 17.19,34.65 17.32,34.83 17.32,34.83 17.33,34.84 17.34,34.85 17.35,34.85 17.38,34.88 17.39,34.89 17.39,34.9 17.4,34.9 17.41,34.91 17.45,34.93 17.46,34.94 17.47,34.94 17.48,34.95 17.49,34.95 17.53,34.96 17.54,34.97 17.55,34.97 17.56,34.97 17.57,34.97 17.61,34.97 17.61,34.98 17.63,34.98 17.64,34.98 17.65,34.98 18.41,34.99 18.41,34.99 18.43,34.99 18.45,34.99 18.45,34.99 18.45,34.99 18.47,34.98 18.49,34.97 18.49,34.97 18.49,34.97 18.5,34.96 18.52,34.94 18.52,34.94 19.18,34.29 19.54,34.29 19.54,35.47 19.4,35.61 17.65,35.61 17.65,35.61 17.63,35.61 17.61,35.61 17.61,35.61 17.05,35.64 17.05,35.64 16.51,35.66 15.81,35.66
AGND  (via drill 0.2)
  other vias: 56.04,21.49 54.62,20.98 51.77,22.91 52.89,24.03 54.82,24.03 53.93,22.73 57.39,21.59
  pour Top (rank 2, no thermals): 56.59,25 55.85,24.27 55.83,24.26 52.79,24.26 51.01,22.47 51.01,20.5 51.17,20.35 53.14,20.35 53.63,20.84 53.66,20.85 58.22,20.85 61.46,24.09 61.48,24.1 67.06,24.1 68.03,25.08 68.03,26.95 56.6,26.95 56.6,25.03
  pour Route2 (rank 2, no thermals): 56.59,25 55.85,24.27 55.83,24.26 52.79,24.26 51.01,22.47 51.01,20.5 51.17,20.35 53.14,20.35 53.63,20.84 53.66,20.85 58.22,20.85 61.46,24.09 61.48,24.1 67.06,24.1 68.03,25.08 68.03,26.95 56.6,26.95 56.6,25.03
AP4_LED1_GREEN  (via drill 0.2)
  Top 0.152: R2.2 58.93,33.78 v57.13,33.78 | XA4.P40 33.67,34.91 v33.97,35.2
  Bottom 0.152: v33.97,35.2 33.99,35.23 43.29,35.23 45.4,33.12 47.53,33.12 50.63,36.22 54.69,36.22 v57.13,33.78
AP4_LED1_RED  (via drill 0.2)
  Top 0.152: 59.68,34.09 59.27,34.49 54.08,34.49 v53.58,33.99 | XA4.P41 35.17,31.84 36.43,33.1 42.07,33.1 v43.01,32.16
  Top 0.203: R5.2 59.68,34.09
  Bottom 0.152: v43.01,32.16 47.89,32.16 50.12,34.39 53.17,34.39 v53.58,33.99
AP4_LED2_BLUE_COMM
  Top 0.203: D1.C1 61.52,34.99 R5.1
AP4_LED_RED_COMM
  Top 0.203: D1.C2 61.64,33.99 R2.1
AP4_RFIOP
  Top 0.356: C2.1 57.54,23.01 arc-62 57.03,22.5 arc-3 54.79,22 arc14 53.88,21.69 arc-35 XA4.P15
  Top 0.508: C2.1 L3.2
  pour Top (no thermals): 57.39,23.8 57.39,22.5 57.92,23.04 57.92,23.8
  pour Top (no thermals): 52.77,20.81 52.99,20.81 53.09,20.84 53.19,20.9 53.27,20.98 53.51,21.25 53.51,21.25 53.51,21.25 53.51,21.25 53.51,21.25 53.78,21.49 53.78,21.49 53.78,21.49 53.78,21.49 53.78,21.49 53.95,21.61 53.95,21.61 53.95,21.61 53.95,21.61 53.95,21.61 54.15,21.7 54.15,21.7 54.15,21.7 54.15,21.7 54.15,21.7 54.35,21.75 54.35,21.75 54.35,21.75 54.35,21.75 54.35,21.75 54.57,21.77 54.57,21.77 54.58,21.78 54.59,21.78 54.59,21.79 54.59,22.12 54.49,22.1 54.49,22.1 54.49,22.1 54.49,22.1 54.49,22.1 54.39,22.09 54.39,22.09 54.39,22.09 54.39,22.09 54.39,22.09 53.58,22.09 53.58,22.09 53.58,22.09 53.57,22.09 53.57,22.09 53.47,22.11 53.47,22.11 53.47,22.11 53.47,22.11 53.47,22.11 53.36,22.14 53.36,22.14 53.36,22.14 53.36,22.14 53.36,22.14 53.27,22.2 53.18,22.25 53.07,22.29 52.97,22.3 52.77,22.3
BATIN  (via drill 0.2)
  Top 0.152: v40.27,24.54 39.66,24.54 38.64,23.52 38.64,22.26 38.84,22.05 XA4.P4
  Bottom 0.152: C27.1 R31.1 41,26.57 R30.2 40.8,24.97 40.37,24.54 v40.27,24.54
BATT_THERM  (via drill 0.2)
  Top 0.152: v22.69,5.03 22.99,5.33 26.45,5.33 28.28,7.16 JP2.3 | JP2.3
  Top 0.203: v5.85,12.65 5.8,12.6 v0.69,12.6
  Route15 0.152: v22.69,5.03 22.49,5.23 22.49,5.94 15.47,18.03 arc30 15.17,18.34 arc60 14.46,18.34 arc2 11.41,16.51 arc-17 7.65,14.88 arc49 6.53,13.97 arc30 6.43,13.46 arc-78 v5.85,12.65
  Bottom 0.203: v0.69,12.6 3.26,12.6 | J4.2SUPP 3.26,12.6 | 3.26,12.6 J4.2
BATT_TS  (via drill 0.2)
  Top 0.152: U3.9 29.1,4.48 28.58,5 28.58,6.45 v28.66,6.53 | v31.32,6.86 30.51,7.67 JP2.2
  Bottom 0.152: v28.66,6.53 30.99,6.53 v31.32,6.86
BLE_ANT_FEED
  Top 0.356: C1.1 59.45,26.77 A4.S1
  pour Top (no thermals): 57.92,27.04 57.92,26.5 58.08,26.5 58.08,26.5 58.08,26.5 58.09,26.5 58.09,26.5 58.15,26.49 58.15,26.49 58.15,26.49 58.15,26.49 58.15,26.48 58.21,26.46 58.21,26.46 58.21,26.46 58.21,26.46 58.21,26.46 58.26,26.42 58.26,26.42 58.26,26.42 58.26,26.42 58.26,26.42 58.3,26.37 58.3,26.37 58.3,26.37 58.3,26.37 58.3,26.37 58.33,26.32 58.33,26.32 58.33,26.32 58.33,26.31 58.33,26.31 58.4,26.16 58.5,26.02 58.62,25.89 58.76,25.79 58.91,25.72 58.98,25.7 59.05,25.7 60.02,25.7 60.02,27.7 59.09,27.7 59.01,27.68 58.83,27.64 58.66,27.56 58.5,27.44 58.36,27.29 58.25,27.13 58.25,27.12 58.25,27.12 58.25,27.12 58.25,27.12 58.17,27.08 58.17,27.08 58.17,27.08 58.17,27.08 58.17,27.08 58.09,27.06 58.09,27.06 58.08,27.06 58.08,27.06 58.08,27.06 58,27.05 57.98,27.04
  pour Top (no thermals): 57.41,25.3 57.94,25.3 57.94,26.37 58.04,26.47 58.04,26.6 57.41,26.6
BQ_AC1
  pour Top (rank 2, no thermals): 41.99,6.51 41.99,5.23 44.53,5.23 44.55,5.22 45.65,4.11 46.67,4.11 46.67,7.87 40.77,7.87 40.77,6.53 41.98,6.53
BQ_AC2
  pour Top (rank 2, no thermals): 41.99,5.03 41.99,3.98 41.98,3.96 40.77,3.96 40.77,2.29 46.77,2.29 46.9,2.29 47.02,2.32 47.14,2.37 47.25,2.44 47.34,2.54 47.41,2.65 47.46,2.77 47.48,2.9 47.48,3.2 47.47,3.34 47.43,3.47 47.36,3.6 47.27,3.7 47.16,3.79 47.04,3.86 46.91,3.9 46.77,3.91 45.55,3.91 44.43,5.03
BQ_BOOT1
  Top 0.203: U4.3 40.5,7.14 41.18,7.82 42.35,7.82 C15.1
BQ_BOOT2
  Top 0.203: U4.17 40,2.2 40.31,1.88 40.95,1.88 41.94,2.87 C16.1
BQ_CLAMP1
  Top 0.203: U4.5 39.5,8.02 39.91,8.43 42.65,8.43 43.59,7.49 C38.1
BQ_CLAMP2
  Top 0.203: U4.16 39.6,3.48 39.6,1.96 40.04,1.52 41.11,1.52 41.92,2.34 43.29,2.34 C39.1
BQ_COMM1
  Top 0.203: U4.6 39,8.03 39.76,8.79 42.81,8.79 43.58,8.02 44.39,8.02 44.91,7.49 C20.1
BQ_COMM2
  Top 0.203: C21.1 45.04,2.79 44.23,1.98 42.07,1.98 41.26,1.17 39.79,1.17 39.15,1.81 39.15,3.05 39,3.2 U4.15
BQ_FOD  (via drill 0.2)
  Top 0.152: R7.1 48.19,1.5 47.58,2.11 v47.58,2.18
  Top 0.203: U4.14 38.5,2.73 v38.49,2.72 | R9.2 47.58,2.06 v47.58,2.18 | R23.2 44.02,1.45 v44.66,0.81
  Bottom 0.203: v38.49,2.72 38.49,2.69 40.32,0.86 44.66,0.86 | 44.66,0.86 v44.66,0.81 | 44.66,0.86 46.26,0.86 v47.58,2.18
BQ_ILM  (via drill 0.2)
  Top 0.203: U4.12 36.91,3.58 v36.81,3.68 | R8.1 45.57,1.63 v44.86,1.63
  Bottom 0.203: v36.81,3.68 36.99,3.51 38.64,3.51 40.52,1.63 v44.86,1.63
BQ_ISET  (via drill 0.2)
  Top 0.152: U3.2 31.86,4.48 v32.19,4.8
  Top 0.203: v30.59,3.4 30.79,3.4 31.5,2.69 R15.2
  Bottom 0.152: v30.59,3.4 30.79,3.4 v32.19,4.8
BQ_RECT  (via drill 0.2)
  Top 0.203: R18.1 42.42,1.37 41.98,1.37 41.27,0.67 39.19,0.67 v39.12,0.74 | U4.18 40.5,2.71 v40.67,2.54
  Top 0.406: C57.1 C56.1 36.77,0.63 C28.1 39.02,0.63 v39.12,0.74
  Route15 0.203: v40.67,2.54 39.12,0.99 v39.12,0.74
BUZZER_GATE  (via drill 0.2)
  Top 0.152: Q2.G 67.49,35.03 v67.49,34.87 | v58.66,33.07 58.07,32.49 R25.1 | XA4.P33 42.65,35.86 43.31,36.53 56.47,36.53 v56.67,36.32
  Route15 0.152: v67.49,34.87 67.49,34.47 66.1,33.07 v58.66,33.07 58.66,33.88 56.95,35.59 56.95,36.04 v56.67,36.32
BUZZER_SUPPLY  (via drill 0.2)
  Top 0.203: v65.16,35.31 64.85,35 64.85,33.38 65.26,32.97 D4.CATHODE C44.1
  Bottom 0.203: v65.16,35.31 64.24,34.39 LS1.+ 64.24,32.97 63.23,31.95 61.09,31.95 60.61,31.47 JP8.2
COIL_AC1
  pour Top (no thermals): 48.29,2.29 48.85,2.29 48.97,2.3 49.08,2.33 49.19,2.39 49.28,2.46 49.36,2.56 49.41,2.66 49.45,2.78 49.46,2.9 49.46,3.76 47.6,5.62 47.58,5.64 47.58,7.87 46.87,7.87 46.87,4.11 47.02,4.1 47.02,4.1 47.03,4.1 47.04,4.1 47.04,4.1 47.17,4.06 47.17,4.06 47.18,4.05 47.19,4.05 47.19,4.05 47.31,3.98 47.31,3.98 47.32,3.98 47.33,3.97 47.33,3.97 47.44,3.88 47.44,3.88 47.44,3.88 47.45,3.87 47.45,3.87 47.54,3.76 47.54,3.76 47.55,3.75 47.55,3.75 47.55,3.74 47.62,3.62 47.62,3.62 47.62,3.61 47.62,3.61 47.62,3.6 47.66,3.47 47.67,3.47 47.67,3.46 47.67,3.45 47.67,3.45 47.68,3.31 47.68,3.31 47.68,3.3 47.68,3.29 47.68,3.29 47.68,2.9 47.69,2.78 47.73,2.66 47.79,2.56 47.86,2.46 47.95,2.39 48.06,2.33 48.17,2.3
DW_SPI_CIPO  (via drill 0.2)
  Top 0.152: XA2.19 v23.2,19.76 23.7,19.25 24.31,19.25 v26.24,21.18 | v40.37,22.91 45.85,22.91 46.46,22.3 XA4.P10 46.46,20.32 v46.72,20.07
  Route15 0.152: v40.37,22.91 40.27,22.91 39.28,21.93 26.99,21.93 v26.24,21.18
  Bottom 0.152: XA1.19 20.84,19.47 21.67,18.64 22.59,18.64 23.2,19.25 v23.2,19.76 | XA3.19 46.72,20.16 v46.72,20.07
DW_SPI_CLK  (via drill 0.2)
  Top 0.152: v22.38,19.35 21.88,19.35 XA2.20 | XA4.P12 49,22.2 | 49,22.2 48.09,23.11 48.09,24.54 47.78,24.84 47.2,24.84 46.08,23.72 41.38,23.72 v41.08,24.03 | v49.69,22.86 49.66,22.86 49,22.2
  Route15 0.152: v41.08,24.03 40.88,23.83 39.35,23.83 38.06,22.54 35.25,22.54 35.18,22.61 30.71,22.61 29.98,23.34 26.07,23.34 v25.94,23.22
  Bottom 0.152: XA1.20 20.87,20.87 v22.38,19.35 22.38,19.86 25.74,23.22 v25.94,23.22 | XA3.20 49.69,21.22 v49.69,22.86
DW_SPI_COPI  (via drill 0.2)
  Top 0.152: v24.01,19.96 23.68,20.55 23.68,21.94 XA2.18 | 46.87,23.32 47.73,22.45 XA4.P11 | 46.87,23.32 47.45,23.9 v47.45,24.16 | v39.55,23.11 39.99,23.55 40.66,23.55 40.81,23.39 45.8,23.39 45.88,23.32 46.87,23.32
  Route15 0.152: v29.6,22.71 29.6,22.5 29.87,22.23 38.67,22.23 v39.55,23.11
  Bottom 0.152: XA1.18 19.75,18.07 20.1,17.73 22.18,17.73 24.01,19.56 v24.01,19.96 26.75,22.71 v29.6,22.71 | v47.45,24.16 47.45,22.81 XA3.18
DWM1_IRQ  (via drill 0.2)
  Top 0.152: XA4.P35 40.11,34.54 39.3,33.73 v38.61,33.73 | v23.3,25.25 22.46,25.25 R24.2
  Bottom 0.152: XA1.22 21.52,23.67 23.09,25.25 v23.3,25.25 25.03,25.25 26.65,26.87 29.8,26.87 30.16,27.23 32.8,27.23 33.46,27.89 33.46,30.12 36.2,32.87 37.75,32.87 v38.61,33.73
DWM1_WAKEUP  (via drill 0.2)
  Top 0.152: XA4.P34 40.88,34.54 v40.88,33.73 | v35.77,31.47 35.82,31.47 36.71,32.36 40.88,32.36 v40.98,32.46
  Bottom 0.152: v40.88,33.73 40.88,32.56 v40.98,32.46 | XA1.2 32.57,25.07 33.97,26.47 33.97,29.21 35.77,31.01 v35.77,31.47
DWM2_IRQ  (via drill 0.2)
  Top 0.152: R1.2 16.92,21.46 | XA2.22 18.63,19.76 16.92,21.46 | v20.76,22.81 19.84,21.89 18.52,21.89 18.09,21.46 16.92,21.46 | v36,33.68 35.03,34.65 XA4.P39
  Route15 0.152: v29.67,25.3 29.72,25.25 32.24,25.25 35.29,28.3 35.29,29.11 36.41,30.23 36.41,33.27 v36,33.68
  Bottom 0.152: v29.67,25.3 25.58,25.3 23.09,22.81 v20.76,22.81
DWM2_WAKEUP  (via drill 0.2)
  Top 0.152: v24.92,6.25 24.64,6.25 23.71,7.18 XA2.2 | XA4.P25 53.33,35.56 v54.41,35.56
  Bottom 0.152: v24.92,6.25 24.92,6.35 25.38,6.81 25.84,7.09 26.57,7.09 31.2,9.71 33.25,11.76 33.25,18.54 34.27,19.56 34.27,29.06 36.41,31.19 36.41,32.16 36.71,32.46 40.06,32.46 40.77,31.75 41.18,31.75 42.22,32.79 47.66,32.79 50.17,35.31 54.16,35.31 v54.41,35.56
DWM3_IRQ  (via drill 0.2)
  Top 0.152: XA4.P22 54.81,30.32 55.28,29.84 55.28,29.54 56.22,28.6 56.22,26.06 v56.01,25.86
  Bottom 0.152: v56.01,25.86 55.61,25.86 55.1,25.35 R10.2 53.19,25.27 51.03,23.11 51.03,22.3 52.36,21.49 52.36,20.06 XA3.22
DWM3_WAKEUP  (via drill 0.2)
  Top 0.152: XA4.P32 43.82,34.94 43.82,30.94 v43.92,30.84
  Route15 0.152: v45.65,19.38 45.65,19.48 46.06,19.89 46.06,23.98 46.41,24.33 v46.41,25.4
  Bottom 0.152: XA3.2 47.91,9.1 47.91,18.31 46.84,19.38 v45.65,19.38 | v43.92,30.84 44.94,29.82 44.94,26.87 v46.41,25.4
FLASH_!CS  (via drill 0.2)
  Top 0.152: R21.1 52.31,18.68 U5.1 50.63,18.15 v50.63,17.73 | XA4.P42 37.25,30.57 37.62,30.94 38.84,30.94 v43.92,25.86
  Route15 0.152: v50.63,17.73 50.63,22.91 50.83,23.11 50.83,23.7 48.27,26.26 44.33,26.26 v43.92,25.86
FLASH_!HOLD!-IO3  (via drill 0.2)
  Top 0.152: XA4.P24 55.11,32.86 55.91,32.05 v55.91,29.92 | v48.8,12.04 48.8,10.91 U5.7 | v49,23.42 49.36,23.77 49.36,24.26 52.28,27.18 v52.86,27.18
  Route15 0.152: v49,23.42 48.9,23.42 48.29,22.81 v48.29,19.53
  Bottom 0.152: v48.29,19.53 48.22,19.46 48.22,12.62 v48.8,12.04 | v52.86,27.18 55.61,29.92 v55.91,29.92
FLASH_!WP!-IO2  (via drill 0.2)
  Top 0.152: U5.3 47.55,19.68 v47.48,19.76 | v48.72,24.21 48.88,24.21 52.86,28.19 52.86,31.14 53.31,31.59 XA4.P23
  Route15 0.152: v47.48,19.76 47.78,20.07 47.78,23.27 v48.72,24.21
FLASH_CLK
  Top 0.152: U5.6 47.25,10.89 46.16,11.98 46.16,16.21 45.35,17.02 45.35,18.75 44.56,19.53 43.34,19.53 42.65,20.22 XA4.P7
FLASH_PDI-IO0
  Top 0.152: U5.5 45.04,12.13 45.04,18.53 44.34,19.23 42.32,19.23 41.38,20.17 XA4.P6
FLASH_PDO-IO1  (via drill 0.2)
  Top 0.152: U5.2 47.77,17.63 v46.74,17.63 | v43.72,18.54 43.41,18.85 41.48,18.85 40.11,20.22 XA4.P5
  Bottom 0.152: v46.74,17.63 46.67,17.63 46.26,18.03 44.94,18.03 44.43,18.54 v43.72,18.54
GND  (via drill 0.2)
  Top 0.152: R14.1 35.72,6.36 35.72,6.19 36.28,5.63 | 36.28,5.63 v36.28,4.88 | U4.10 36.81,6.01 36.62,5.82 36.46,5.82 36.28,5.63 | U4.11 36.8,4.46 36.38,4.88 v36.28,4.88 | C30.2 35.52,3.33 36.28,4.09 v36.28,4.88 | R25.2 57.33,32.13 v57.33,31.24 | U4.PAD 40.19,5.84 v40.14,5.84 | R27.1 12.33,34.29 9.89,34.29 9.58,34.59 v9.58,35.31 | R26.1 14.2,27.05 14.56,26.7 16.39,26.7 16.69,26.39 v16.69,26.29 | U6.25 40.71,15.76 v41.54,16.59 | C6.P$1 42.32,17.85 v42.6,18.14 | v38.44,18.54 38.23,18.34 C5.P$1 | v37.78,11.33 38.21,10.9 C43.2 38.71,10.01 39.45,10.01 39.58,10.13 39.58,10.9 38.71,11.76 U6.6 38.7,12.41 | U6.5 39.51,13.21 v40.14,13.84 | U6.2 37.69,14.71 36.99,15.42 35.95,15.42 v35.92,15.44 | v44.33,14.78 44.02,14.78 43.46,14.21 U6.18 | v37.7,36.37 37.57,36.25 XA4.P37 37.57,35.41 v36.61,36.37 | R1.1 14.89,22.33 v14.46,21.89 | R24.1 22.49,26.09 23.58,26.09 v23.6,26.06 | J1.5 65.67,13.94 v65.67,14.07 | RX7.1 33.15,7.57 v33.76,8.18 | XR19.1 33.53,10.18 v33.53,10.29
  Top 0.203: U3.7 30.34,5.28 v30.41,5.21 | 41.16,5.94 40.24,5.94 v40.14,5.84 | VR1.9 13.18,29.99 VR1.13 13.63,30.44 VR1.3 | U3.3 U3.PAD | C30.2 35.52,2.4 C57.2 | Q2.S 67.03,35.97 66.63,36.37 v65.56,36.37 | C44.2 66.71,34.09 v66.71,34.65 | C42.2 v30.61,2.59 | R15.1 32.8,2.59 v33.2,2.18 33.2,2.01 v33.69,1.52 | 47.19,8.61 C53.2 | R14.1 36.32,6.56 v36.38,6.5 36.87,6.01 U4.10 | U4.9 37.19,6.88 v36.81,7.26
  Top 0.305: U4.10 38.25,6.01 v38.41,5.84 | U4.11 38.25,4.46 v38.41,4.62 | 41.16,4.52 40.24,4.52 v40.14,4.62 | v50.22,1.02 49.79,1.45 R6.2 | C57.2 C56.2 | C56.2 37.51,2.02 C28.2 38.03,1.75 37.75,2.03 v37.75,2.34 37.65,2.24 36.9,2.24 C56.2 | v17.41,33.07 17.41,33.34 C47.1 18.29,33.87 v18.29,33.07 18.87,32.5 C45.1 18.87,31.28 v18.22,30.63 v18.22,29.51 | v37.45,17.98 37.14,17.98 36.38,17.22 C31.2 | C32.2 36.61,14.15 v36.61,12.95 | XA2.8 v32.34,11.94 | XA2.24 15.07,19.08 v15.07,20.07 | XA2.23 16.19,19.88 v16.19,20.07 | XA2.21 19.84,19.33 v20.81,18.36 | XA2.16 28.17,23.58 v28.17,24.43 | U5.4 46.28,18.52 45.98,18.21 v45.98,17.32 | v49.23,8.59 48.93,8.28 47.52,8.28 47.19,8.61 | v48.62,8.94 48.32,8.94 47.77,9.49 45.41,9.49 C29.2 | XA4.P13 50.48,21.75 50.48,23.22 50.07,23.62 v49.99,23.62
  Top 0.406: C35.2 v51.55,15.79 v51.54,15.8
  Route2 0.152: v65.67,14.07 65.67,14.99 65.06,15.6 60.41,15.6 55.71,18.24 55.2,18.54 54.79,18.54 v53.27,16.1
  Route2 1.27: 32.92,3.91 35.62,3.91
  Bottom 0.152: JP6.1 45.19,14.13 44.53,14.78 v44.33,14.78 | R30.1 39.93,25.48 v39.96,25.45 | C27.2 38.84,29.01 v38.64,29.21 | R10.1 51.52,24.54 v50.96,24.54
  Bottom 0.305: v49.99,2.31 49.99,1.24 v50.22,1.02 | XA1.21 17.07,22.27 v16.9,22.1 | v21.57,24.84 21.34,25.07 XA1.23 | XA1.24 20.35,26.47 v20.76,26.06 | XA1.16 20.33,12.77 v20.66,12.45 | XA3.21 49.71,19.33 v49.71,17.53 | XA3.8 40.75,13.41 v40.75,13.49 | XA1.8 31.11,16.26 v29.06,16.26 | XA3.16 41.79,24.29 v41.79,24.43
  Bottom 0.406: XA3.24 54.06,17.95 54.06,17.51 53.27,16.71 v53.27,16.1 | XA3.23 52.25,18.05 52.25,17.22 v52.15,17.12
  Bottom 0.61: 8.16,27.08 arc160 6.76,24.39 arc-12 7.65,23.62 arc-47 8.77,20.57 arc7 8.77,19.25 arc-13 8.67,17.53 arc-58 7.35,15.9 arc46 6.23,14.78 arc-59 5.37,14.33 J4.1SUPP J4.1
  other vias: 48.19,5.54 49.13,4.62 39.22,5.23 37.8,5.23 40.75,5.23 49.99,3.53 30.41,4.5 12.73,30.63 12.73,29.82 14.05,30.63 14.05,29.82 15.98,29.62 15.98,28.8 8.57,35.31 8.67,33.17 9.58,32.66 7.55,28.4 9.07,30.33 8.26,29.24 8.67,27.41 7.96,30.33 13.54,24.74 13.54,25.65 13.54,26.57 16.69,36.27 17.53,36.27 56.12,32.87 49.92,27.89 23.96,18.36 26.09,17.35 26.6,24.56
  pour Bottom (rank 6): 6.5,23.17 6.48,23.15 6.45,23.14 -1.52,23.14 -1.57,-1.65 71.84,-1.65 71.99,19.18 55.41,19.18 55.41,19.18 55.4,19.18 55.39,19.18 55.38,19.18 55.38,19.18 55.37,19.18 55.36,19.19 55.36,19.19 50.6,21.85 50.59,21.85 50.58,21.86 50.58,21.86 50.57,21.87 50.56,21.88 50.56,21.88 50.56,21.88 50.56,21.89 50.55,21.9 50.55,21.91 50.55,21.91 50.55,21.92 50.55,22.21 50.56,22.24 55.67,27.34 55.69,27.36 58.17,27.36 58.17,31.36 58.18,31.39 59.22,32.42 59.25,32.44 70.26,32.44 70.26,42.29 42.08,42.29 34.75,34.97 34.75,26.96 34.74,26.93 34.72,26.91 34.69,26.9 18.71,26.9 18.68,26.91 18.66,26.93 18.65,26.96 18.65,35.49 12.1,42.01 6.51,41.98 6.51,23.2
  pour Top (rank 6): 7.01,22.97 6.98,22.95 6.96,22.94 -1.31,22.94 -1.47,-1.14 69.6,-1.14 69.6,41.99 41.77,41.99 34.75,34.97 34.75,26.96 34.74,26.93 34.72,26.91 34.69,26.9 18.71,26.9 18.68,26.91 18.66,26.93 18.65,26.96 18.65,35.48 12.1,42.01 7.02,41.99 7.02,23
  pour Route2 (rank 6): 7.21,23.07 7.19,23.05 7.16,23.04 -1.42,23.04 -1.47,-1.35 69.81,-1.35 69.81,41.99 41.67,41.99 34.04,34.36 34.04,27.06 34.03,27.03 34.01,27.01 33.98,27 18.61,27 18.58,27.01 18.56,27.03 18.55,27.06 18.55,35.58 12.19,41.94 7.22,41.94 7.22,23.1
  pour Top (rank 4): 50.4,-0.33 50.4,3.83 49.34,4.88 49.33,4.91 49.33,8.81 48.77,9.37 34.3,9.37 34.3,-0.33
  pour Route2 (rank 4): 50.45,-0.43 50.45,3.78 49.34,4.88 49.33,4.91 49.33,8.81 48.62,9.53 34.61,9.53 34.3,9.21 34.3,-0.43
  pour Route15 (rank 4): 50.45,-0.63 50.45,3.78 49.34,4.88 49.33,4.91 49.33,8.81 48.62,9.53 34.61,9.53 34.3,9.21 34.3,-0.63
  pour Bottom (rank 4): 50.45,-0.84 50.45,3.78 49.34,4.88 49.33,4.91 49.33,8.81 48.62,9.53 34.61,9.53 34.3,9.21 34.3,-0.84
  pour Top (no thermals): 40.67,4.72 40.67,4.22 41.18,4.22 41.19,4.2 41.59,3.81 41.79,3.81 42.3,4.32 42.3,6.15 41.79,6.65 41.59,6.65 41.18,6.25 40.67,6.25 40.67,5.74 41.7,5.74 41.79,5.65 41.79,4.82 41.7,4.72
  pour Route15 (rank 3): 34.89,26.83 34.82,26.76 34.73,26.72 11.69,26.72 11.69,23.19 23.4,11.48 51.89,11.48 59.74,19.33 59.75,20.51 59.75,20.52 59.75,20.56 59.75,20.6 59.76,20.61 59.79,21.03 59.78,21.04 59.79,21.08 59.79,21.11 59.8,21.13 59.89,21.54 59.89,21.56 59.9,21.59 59.91,21.62 59.92,21.64 60.07,22.03 60.07,22.05 60.08,22.08 60.09,22.11 60.11,22.13 60.31,22.5 60.32,22.52 60.34,22.54 60.35,22.57 60.37,22.58 60.62,22.92 60.63,22.94 60.65,22.96 60.67,22.99 60.69,23 60.99,23.3 61,23.31 61.02,23.33 61.04,23.36 61.06,23.36 61.4,23.62 61.41,23.63 61.44,23.65 61.47,23.67 61.49,23.67 61.86,23.88 61.87,23.89 61.9,23.9 61.93,23.92 61.95,23.92 62.35,24.07 62.36,24.08 62.39,24.08 62.42,24.09 62.44,24.09 62.86,24.18 62.87,24.19 62.91,24.19 62.94,24.2 62.96,24.2 63.37,24.23 63.38,24.23 63.42,24.23 63.46,24.23 63.47,24.23 67.08,24.23 67.23,24.24 67.37,24.28 67.49,24.34 67.61,24.42 67.71,24.52 67.79,24.64 67.85,24.77 67.89,24.9 67.9,25.05 67.9,32.11 60.43,32.11 60.34,32.14 60.27,32.22 60.23,32.31 60.23,36.73 36.76,36.73 34.93,34.89 34.93,26.92
GP82/SWTRACE2  (via drill 0.2)
  Top 0.152: XA4.P18 51.38,25.24 v51.34,25.27
  Bottom 0.152: v51.34,25.27 50.63,25.27 50.43,25.07 47.5,25.07 47.17,24.74 46.1,24.74 RZ2.2
GP83/SWTRACE3  (via drill 0.2)
  Top 0.152: XA4.P19 54.48,26.51 55.58,27.61 v55.58,28.09
  Route15 0.152: v55.58,28.09 55.58,27.76 53.78,25.96 49,25.96 47.48,27.48 46.16,27.48 45.14,28.5 44.33,28.5 v43.92,28.09
  Bottom 0.152: v43.92,28.09 43.86,28.15 RZ3.2
LED_SUP  (via drill 0.2)
  Top 0.203: D1.A2 D1.A1 64.2,35.2 63.59,35.81 v61.4,35.81
  Bottom 0.203: v61.4,35.81 60.24,34.66 RZ1.1
N$2  (via drill 0.2)
  Top 0.203: D4.ANODE 65.56,34.49 v65.87,34.8 66.33,35.26 Q2.D
  Bottom 0.203: LS1.- 64.63,30.71 65.56,31.65 65.56,34.49 v65.87,34.8
N$28
  Top 0.203: R7.2 R6.1
N$42  (via drill 0.2)
  Top 0.152: U6.17 43.67,13.71 44.13,13.26 v44.13,12.34
  Bottom 0.152: v44.13,12.34 44.13,12.95 44.38,13.2 JP6.2
N$47
  Top 0.152: JP2.1 32.09,9.13 XR19.2
N$49
  Top 0.152: RX7.2 32.95,6.53 31.7,5.28 U3.4
N$64
  Top 0.203: R18.2 R23.1
N$66
  Top 0.203: R9.1 R8.2
N$69
  Top 0.152: R13.2 RT1.1
N$70
  Top 0.152: R14.2 R13.1
QI_TS_CTRL  (via drill 0.2)
  Top 0.152: U4.13 38,3.37 37.59,2.97 v36.38,2.97 | RT1.2 C30.1 34.14,2.69 v33.86,2.69 | XA4.P44 33.37,28.03 32.66,27.31 32.66,25.36 32.06,24.76 32.06,18.62 33.56,17.12 33.56,15.6 34.2,14.96 v34.2,11.94
  Bottom 0.152: v36.38,2.97 36.1,2.69 v33.86,2.69 33.86,4.22 32.44,5.64 32.44,8.28 34.17,10.01 34.17,11.91 v34.2,11.94
VBAT  (via drill 0.2)
  Top 0.203: U3.10 29.46,3.88 v29.01,3.43
  Top 0.508: v29.01,3.43 29.01,3.35 28.86,3.2 C42.1
  Top 0.61: v29.01,3.43 v28.3,3.68
  Route15 0.254: 0.69,14.17 v0.69,14.27
  Route15 0.508: v0.69,8.99 v0.69,10.41 v0.69,11.73 0.74,11.73 arc90 1.56,12.55 1.56,12.6 arc90 v0.69,13.46 0.69,14.17 v0.69,15.09 0.9,14.88 4.99,14.88
  Route15 0.61: v0.69,14.27 arc-5 2.88,14.58 arc31 13.55,18.64 arc-43 15.25,19.1 arc-53 15.72,18.8 24.36,4.51 JP9.1 arc-100 27.26,5.54 arc-77 28.3,4.22 v28.3,3.68 | v5.92,27.99 6.43,25.76 arc29 7.65,23.42 arc-42 8.77,20.57 8.77,17.61 arc-45 8.57,17.12 7.28,15.83 arc-45 4.99,14.88
  Bottom 0.203: v0.69,13.46 1.25,13.46 1.76,13.97 | v0.69,14.27 1.69,14.27 J4.3SUPP 1.01,15.09 v0.69,15.09 | v0.69,8.99 1.73,10.03 1.73,10.41 | v0.69,10.41 1.73,10.41 | 1.73,10.41 J4.3 | v0.69,11.73 1.73,10.7 1.73,10.41
  Bottom 0.305: J4.3SUPP 1.76,13.97
  other vias: 6.53,30.12 5.92,29.41 6.53,28.7
  pour Top (no thermals): 28.38,3.05 29.31,3.05 29.7,3.44 29.7,4.27 28.28,4.27 27.87,3.86 27.87,3.56
  pour Route15 (rank 4): 6.67,24.41 7.22,24.41 6.97,25.12 6.97,25.13 6.97,25.13 6.97,25.14 6.97,25.15 6.97,30.51 5.37,30.51 5.37,25.71
  pour Bottom (no thermals): 3.99,30.43 3.99,29.31 5.54,29.31 5.58,29.3 5.6,29.27 5.62,29.23 5.62,27.69 6.94,27.69 6.94,30.43
VBAT_SWITCHED  (via drill 0.2)
  Top 0.152: 18.01,27.18 18.01,28.4 17.2,29.21 v17.2,30.84 | 18.01,27.18 18.42,26.77 24.21,26.77 v24.72,26.26 | VR1.6 12.28,32.55 v12.5,32.77 | VR1.12 14.53,28.42 14.87,28.09 17.1,28.09 18.01,27.18
  Top 0.305: C45.2 17.57,31.2 v17.2,30.84 | v16.08,31.45 17.06,31.45 C45.2 | v16.49,30.84 17.57,31.91 C45.2
  Route15 0.152: v24.72,26.26 27.54,26.26 29.14,24.66 32.09,24.66 35.59,28.17 35.59,28.9 36.3,29.62 37.32,29.62 v39.25,27.69 39.45,27.48 41.48,27.48 42.2,26.77 45.7,26.77 v45.83,26.9 | v12.5,32.77 12.53,32.74 12.53,31.65
  Bottom 0.152: R31.2 v39.25,27.69 | v45.83,26.9 46.34,26.9 46.92,27.48 49.31,27.48 50.25,26.54 55.07,26.54 59.19,30.66 JP8.1
  other vias: 7.65,31.45 6.23,31.45 6.94,31.95 8.36,31.95
  pour Bottom (rank 2, no thermals): 3.99,30.73 8.77,30.73 8.77,32.46 3.99,32.46
  pour Route15 (rank 2): 15.59,30.45 17.58,30.45 17.58,31.03 16.35,32.26 5.92,32.26 5.92,30.86 15.19,30.84 15.2,30.84 15.2,30.84 15.2,30.84 15.21,30.83
  pour Top (isolate 0.102, no thermals): 12.17,28.47 12.2,28.47 12.2,29.06 12.17,29.07 12.16,29.07 12.15,29.07 12.14,29.07 12.13,29.07 12.05,29.1 12.04,29.1 12.03,29.11 12.02,29.11 12.01,29.11 11.93,29.15 11.92,29.16 11.92,29.16 11.91,29.17 11.9,29.18 11.83,29.23 11.82,29.23 11.82,29.24 11.81,29.25 11.8,29.26 11.75,29.32 11.74,29.33 11.74,29.34 11.73,29.35 11.73,29.36 11.69,29.42 11.69,29.42 11.68,29.44 11.67,29.46 11.67,29.46 11.62,29.53 11.56,29.61 11.48,29.68 11.4,29.72 11.3,29.75 11.2,29.77 10.27,29.77 10.27,28.55 10.96,28.55 10.97,28.55 10.98,28.55 11,28.55 11,28.55 11.32,28.53 11.33,28.53 11.34,28.52 11.36,28.52 11.36,28.52 11.76,28.48
  pour Top (isolate 0.102, no thermals): 17.16,31.79 17.13,31.77 17.1,31.75 15.9,31.75 15.9,31.75 15.88,31.75 15.86,31.75 15.86,31.75 15.61,31.76 15.6,31.76 15.59,31.76 15.57,31.76 15.57,31.77 15.32,31.8 15.31,31.8 15.3,31.81 15.28,31.81 15.28,31.81 15.02,31.88 14.79,31.93 14.56,31.95 14.55,31.95 14.54,31.95 14.54,31.95 14.54,31.36 14.56,31.35 14.58,31.35 14.59,31.35 14.6,31.34 14.62,31.34 14.62,31.34 14.7,31.32 14.71,31.32 14.72,31.32 14.73,31.32 14.74,31.31 14.82,31.28 14.83,31.27 14.84,31.27 14.85,31.27 14.85,31.26 14.92,31.21 14.94,31.2 14.94,31.19 14.95,31.19 14.95,31.18 15.01,31.12 15.01,31.12 15.02,31.1 15.03,31.09 15.03,31.09 15.16,30.93 15.32,30.79 15.5,30.68 15.69,30.6 15.9,30.55 16.11,30.53 17.81,30.53 17.81,32.46 17.18,32.46 17.18,31.83
  pour Top (isolate 0.102, no thermals): 10.28,29.88 10.29,29.84 10.29,28.6 10.7,28.6 10.7,30.59 9.03,32.26 5.92,32.26 5.92,30.84 9.3,30.84 9.34,30.82
VQI  (via drill 0.2)
  Top 0.203: U4.4 40,7.58 v40.19,7.77 | 31.44,4 U3.1 | 45.82,8.62 C53.1
  Top 0.305: C41.1 33.08,4.65 32.43,4 31.44,4 | v39.33,9.3 39.43,9.19 43.11,9.19 43.69,8.62 C29.1 45.82,8.62
  Top 0.406: v33.41,5.61 33.41,4.85 C41.1
  Bottom 0.203: 39.31,9.28 v39.33,9.3
  Bottom 0.305: v40.19,7.77 40.19,8.41 39.31,9.28 38.11,8.08 35.9,8.08 33.43,5.61 v33.41,5.61
VR1_FB1
  Top 0.203: VR1.4 13.18,33.12 12.78,33.53 R27.2 12.27,33.53 11.67,32.92 R29.2 11.69,32.84 C8.P$1
VR1_FB2
  Top 0.203: C7.P$2 15.34,27.66 R28.1 R26.2 13.63,28.21 VR1.10
VR1_LX1
  pour Top (isolate 0.102, no thermals): 12.16,24.5 12.97,24.5 12.97,28.04 12.94,28.15 12.9,28.26 12.9,28.26 12.9,28.27 12.9,28.27 12.9,28.27 12.86,28.37 12.86,28.37 12.86,28.37 12.85,28.38 12.85,28.38 12.83,28.48 12.83,28.48 12.83,28.48 12.83,28.49 12.83,28.49 12.82,28.59 12.82,28.6 12.82,28.6 12.82,28.6 12.82,28.61 12.82,28.94 12.64,28.94 12.64,28.6 12.64,28.55 12.65,28.55 12.64,28.55 12.64,28.54 12.64,28.54 12.64,28.5 12.64,28.5 12.64,28.49 12.64,28.49 12.63,28.49 12.62,28.44 12.61,28.38 12.61,28.38 12.6,28.38 12.6,28.37 12.6,28.37 12.58,28.32
VR1_LX2
  Top 0.152: VR1.2 14.08,32.88 13.78,33.18 13.78,34.25 L1.P$1
  pour Top (no thermals): 14.09,31.76 14.09,31.76 14.1,31.76 14.1,31.76 14.1,31.76 14.11,31.77 14.13,31.9 14.13,32.02 14.13,32.02 14.13,32.03 14.13,32.05 14.13,32.05 14.13,32.15 14.13,32.16 14.13,32.17 14.13,32.17 14.13,32.18 14.15,32.28 14.15,32.28 14.16,32.3 14.16,32.31 14.16,32.31 14.23,32.67 14.26,33.05 14.26,35.66 13.6,35.66 13.6,33.07 13.6,33 13.62,32.93 13.65,32.87 13.7,32.82 13.8,32.72 13.81,32.72 13.81,32.71 13.82,32.7 13.82,32.7 13.9,32.59 13.9,32.58 13.9,32.57 13.91,32.57 13.91,32.56 13.97,32.44 13.97,32.43 13.97,32.43 13.98,32.42 13.98,32.41 14.01,32.28 14.01,32.28 14.01,32.27 14.02,32.26 14.02,32.25 14.03,32.13 14.03,32.13 14.03,32.11 14.03,32.1 14.03,32.1 14.03,32.03 14.05,31.94 14.07,31.88 14.07,31.88 14.07,31.86 14.07,31.85 14.07,31.85 14.08,31.78 14.08,31.77 14.08,31.76 14.08,31.76
(copper drawn outside any net)
  shapes: Bottom area x4, Route15 area x5, Route2 area x4, Top area x6

## Text on the board
tPlace: Pat Pannuto | TotTag | 2023-09 | c0:98:e5:42 | ON | : | : | OFF | 9DOF / Debug
bPlace: ON | c0:98:e5:42 | OFF | : | :
tNames: GND | VBAT
bNames: GND | VBAT
Measures: 1 Inch | 1 cm | 1 mm
Document: Fabrication Notes | Stackup | Designed for CircuitHub std 4-Layer 1.6mm stackup: / Er H(mm) [ mil] Wg(oz) / 1 Top Copper Sig(GND) 0.035 [ 1.4] 1 / 7630 Prepreg 4.7 0.2 [ 7.9] / 2 In1 Copper Plane(GND) 0.035 [ 1.4] 1 / [Fr-4?] Core 4.6 1.03 [40.6] / 3 In2 Copper Plane(PWR) 0.035 [ 1.4] 1 / 7630 Prepreg 4.7 0.2 [ 7.9] / 4 Bot Copper Sig(GND) 0.035 [ 1.4] 1 | Impedence Control | 50Ω for Bluetooh RF [2.4 GHz] / - Controlled traces run from XA1-A4 / / All modeled as Coplanar waveguide. / SaturnPCB Calculator Configuration: / W=14 mil (0.356 mm) / H= 7.87mil / G=10 mil / [W/H=1.779 < 2, √] / Er 4.7 is high end for 7630 materials / 4.7 -> 49.9 Ω / 4.6 -> 50.4 Ω / reasonable hedge | Panelization | Any OK. / OK to leave mouse bite tabs any edge.
Reference: Light Pipe Aperature / (LEDs should be under this)
tDocu: Nordic forums suggest higher parasitics / if waveguide is made with internal layers, / so block copper on inner layers. / / Trace width calc's for coplanar wave: / 28 mil Conductor W / 59 mil (1.6 mm) Conductor H / 4 mil Conductor Gap [must match DW traces for single plane pour] / ~= 49.999 ohm | https://abracon.com/uploads/resources/AMCA-Series-Multilayer-Chip-Antenna-Application-Note.pdf / / Goal is 10mm no-metal width, antenna in center (doc lines are 5mm) / / Goal is 14mm no-metal length, from plane edge (goes off board, no problem) / / Seems to be no feed gap in reference design
AntRefLayout: 1.22 | 1.85 | 1.0 | ??? | 3.42 | 6.0 | 0.85 | 1.85 | 0.74 | 1.8 | 0.95 | 0.3 | 5.0 | 0.3